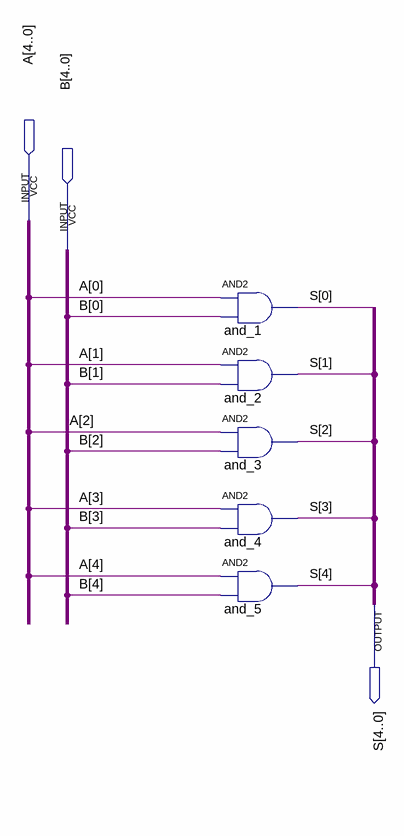
[diagram p0: schematic sheet]
// Quartus schematic AND_completo.bdf as structural Verilog: 5 symbols, 3 pins
module AND_completo (
  input  [4:0] A,
  input  [4:0] B,
  output [4:0] S
);

  and and_1 (S[0], A[0], B[0]);
  and and_2 (S[1], A[1], B[1]);
  and and_3 (S[2], A[2], B[2]);
  and and_4 (S[3], A[3], B[3]);
  and and_5 (S[4], A[4], B[4]);
endmodule
